# EasyEDA Pro project 二版平衡车pcb.epro, board PCB3
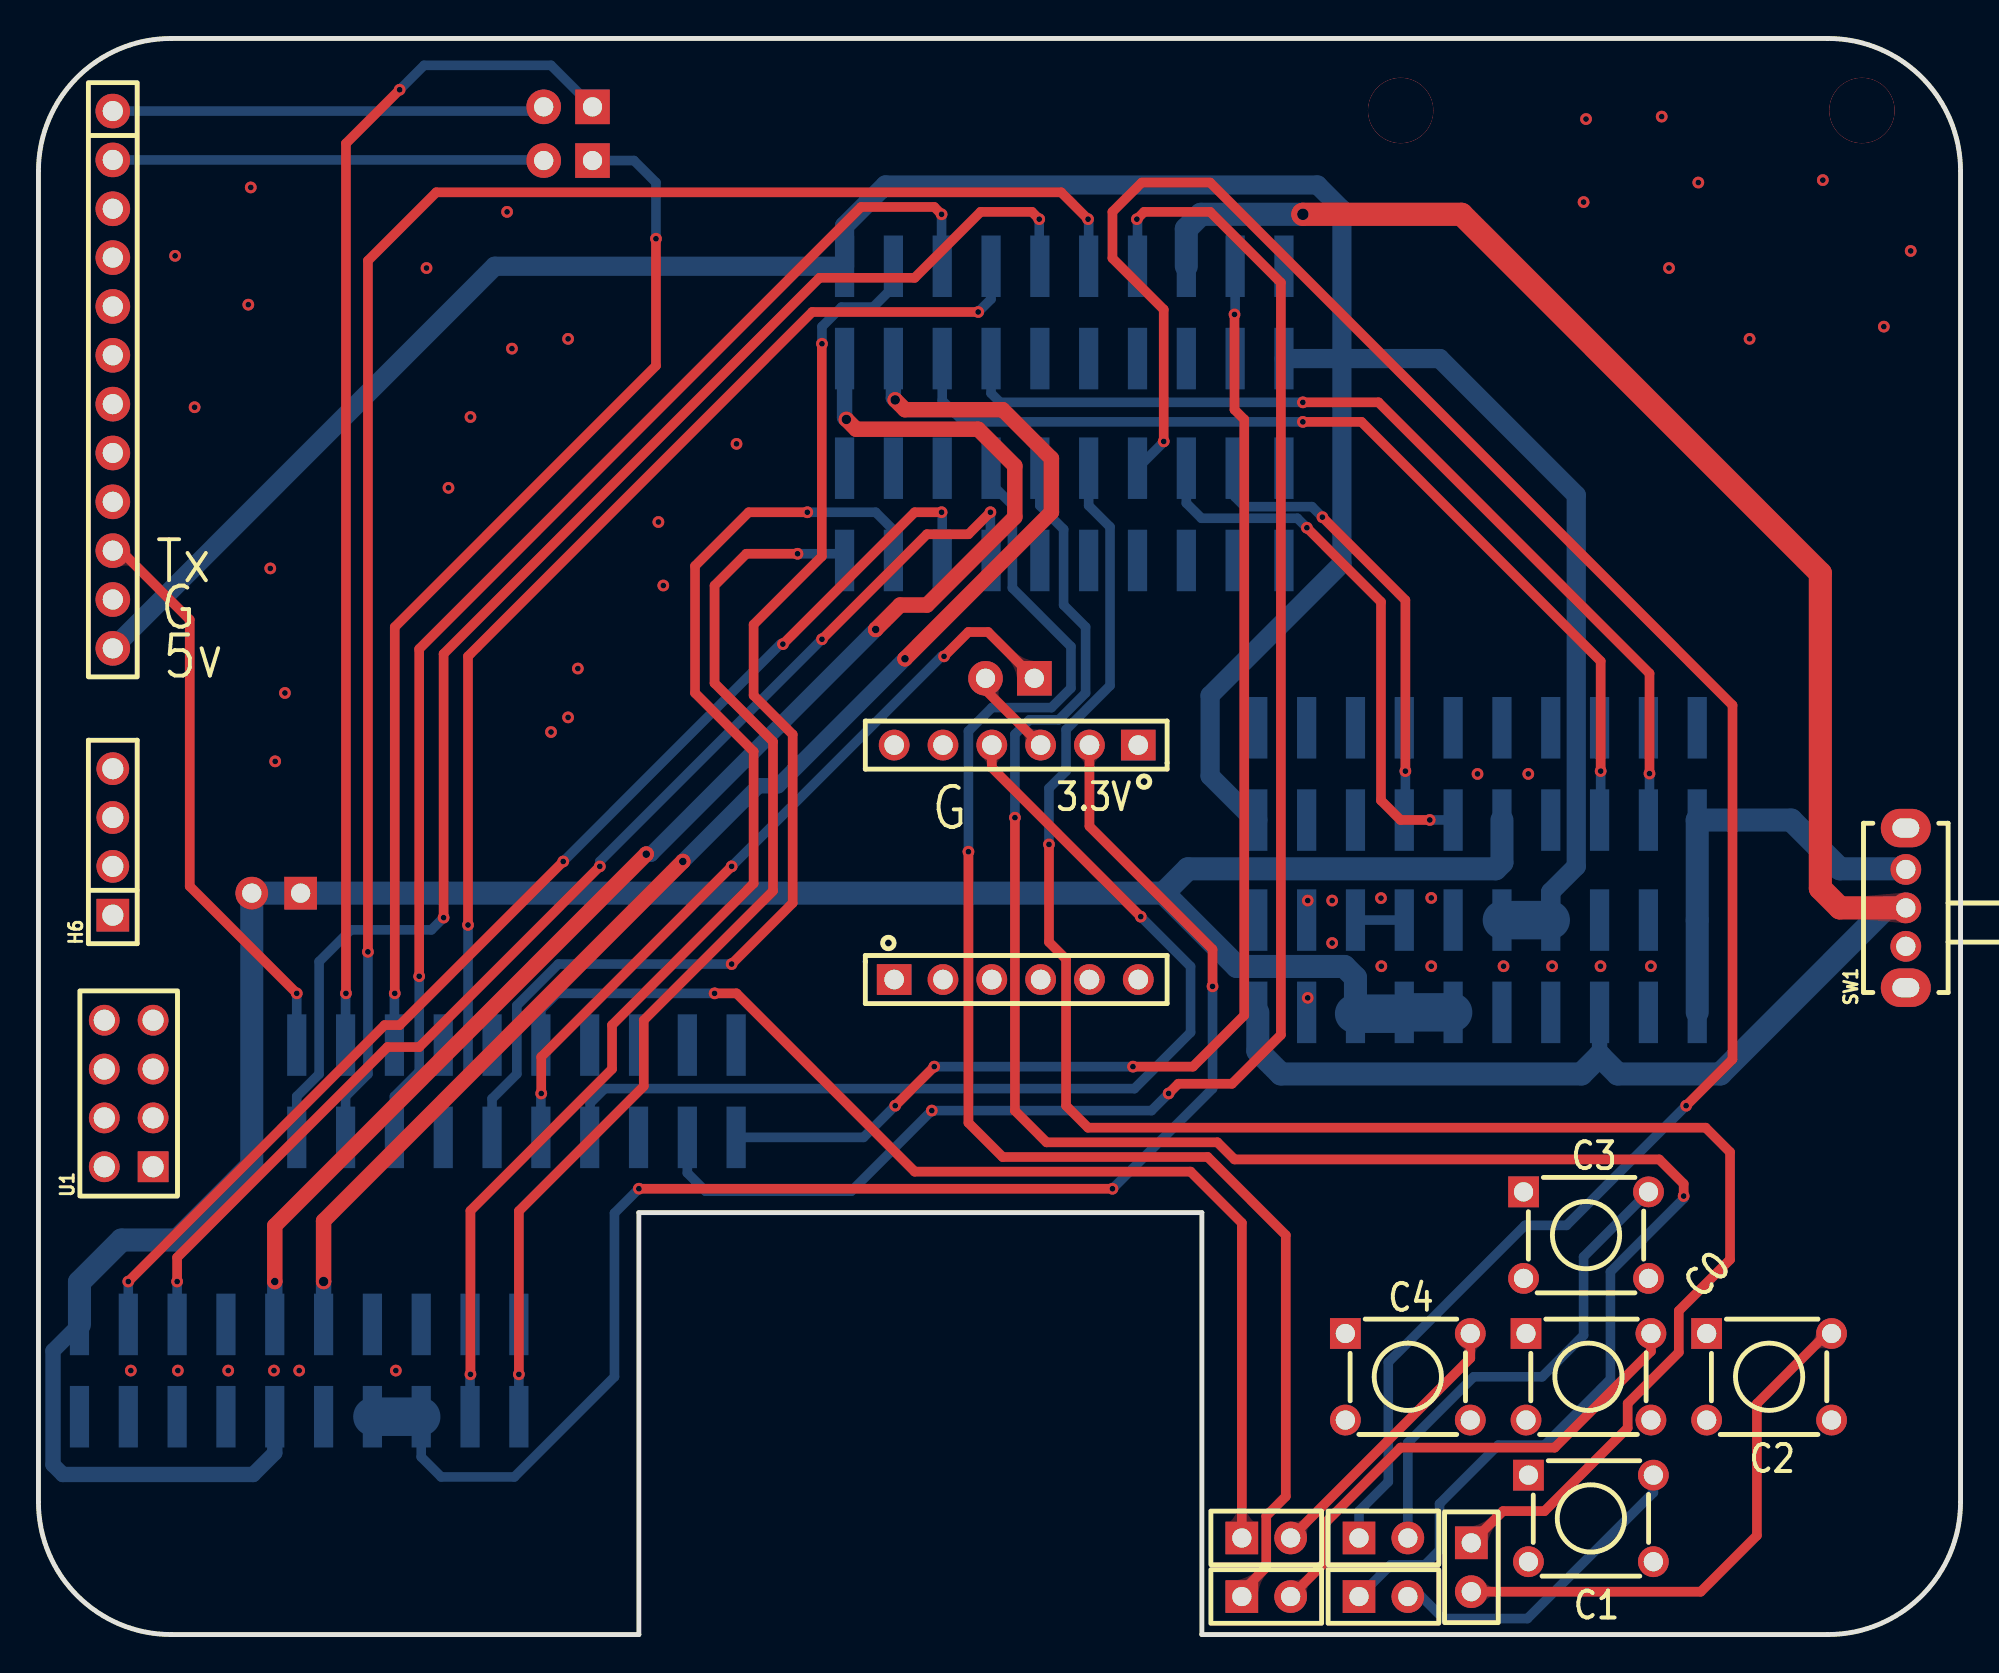
[diagram p4: board, top side]
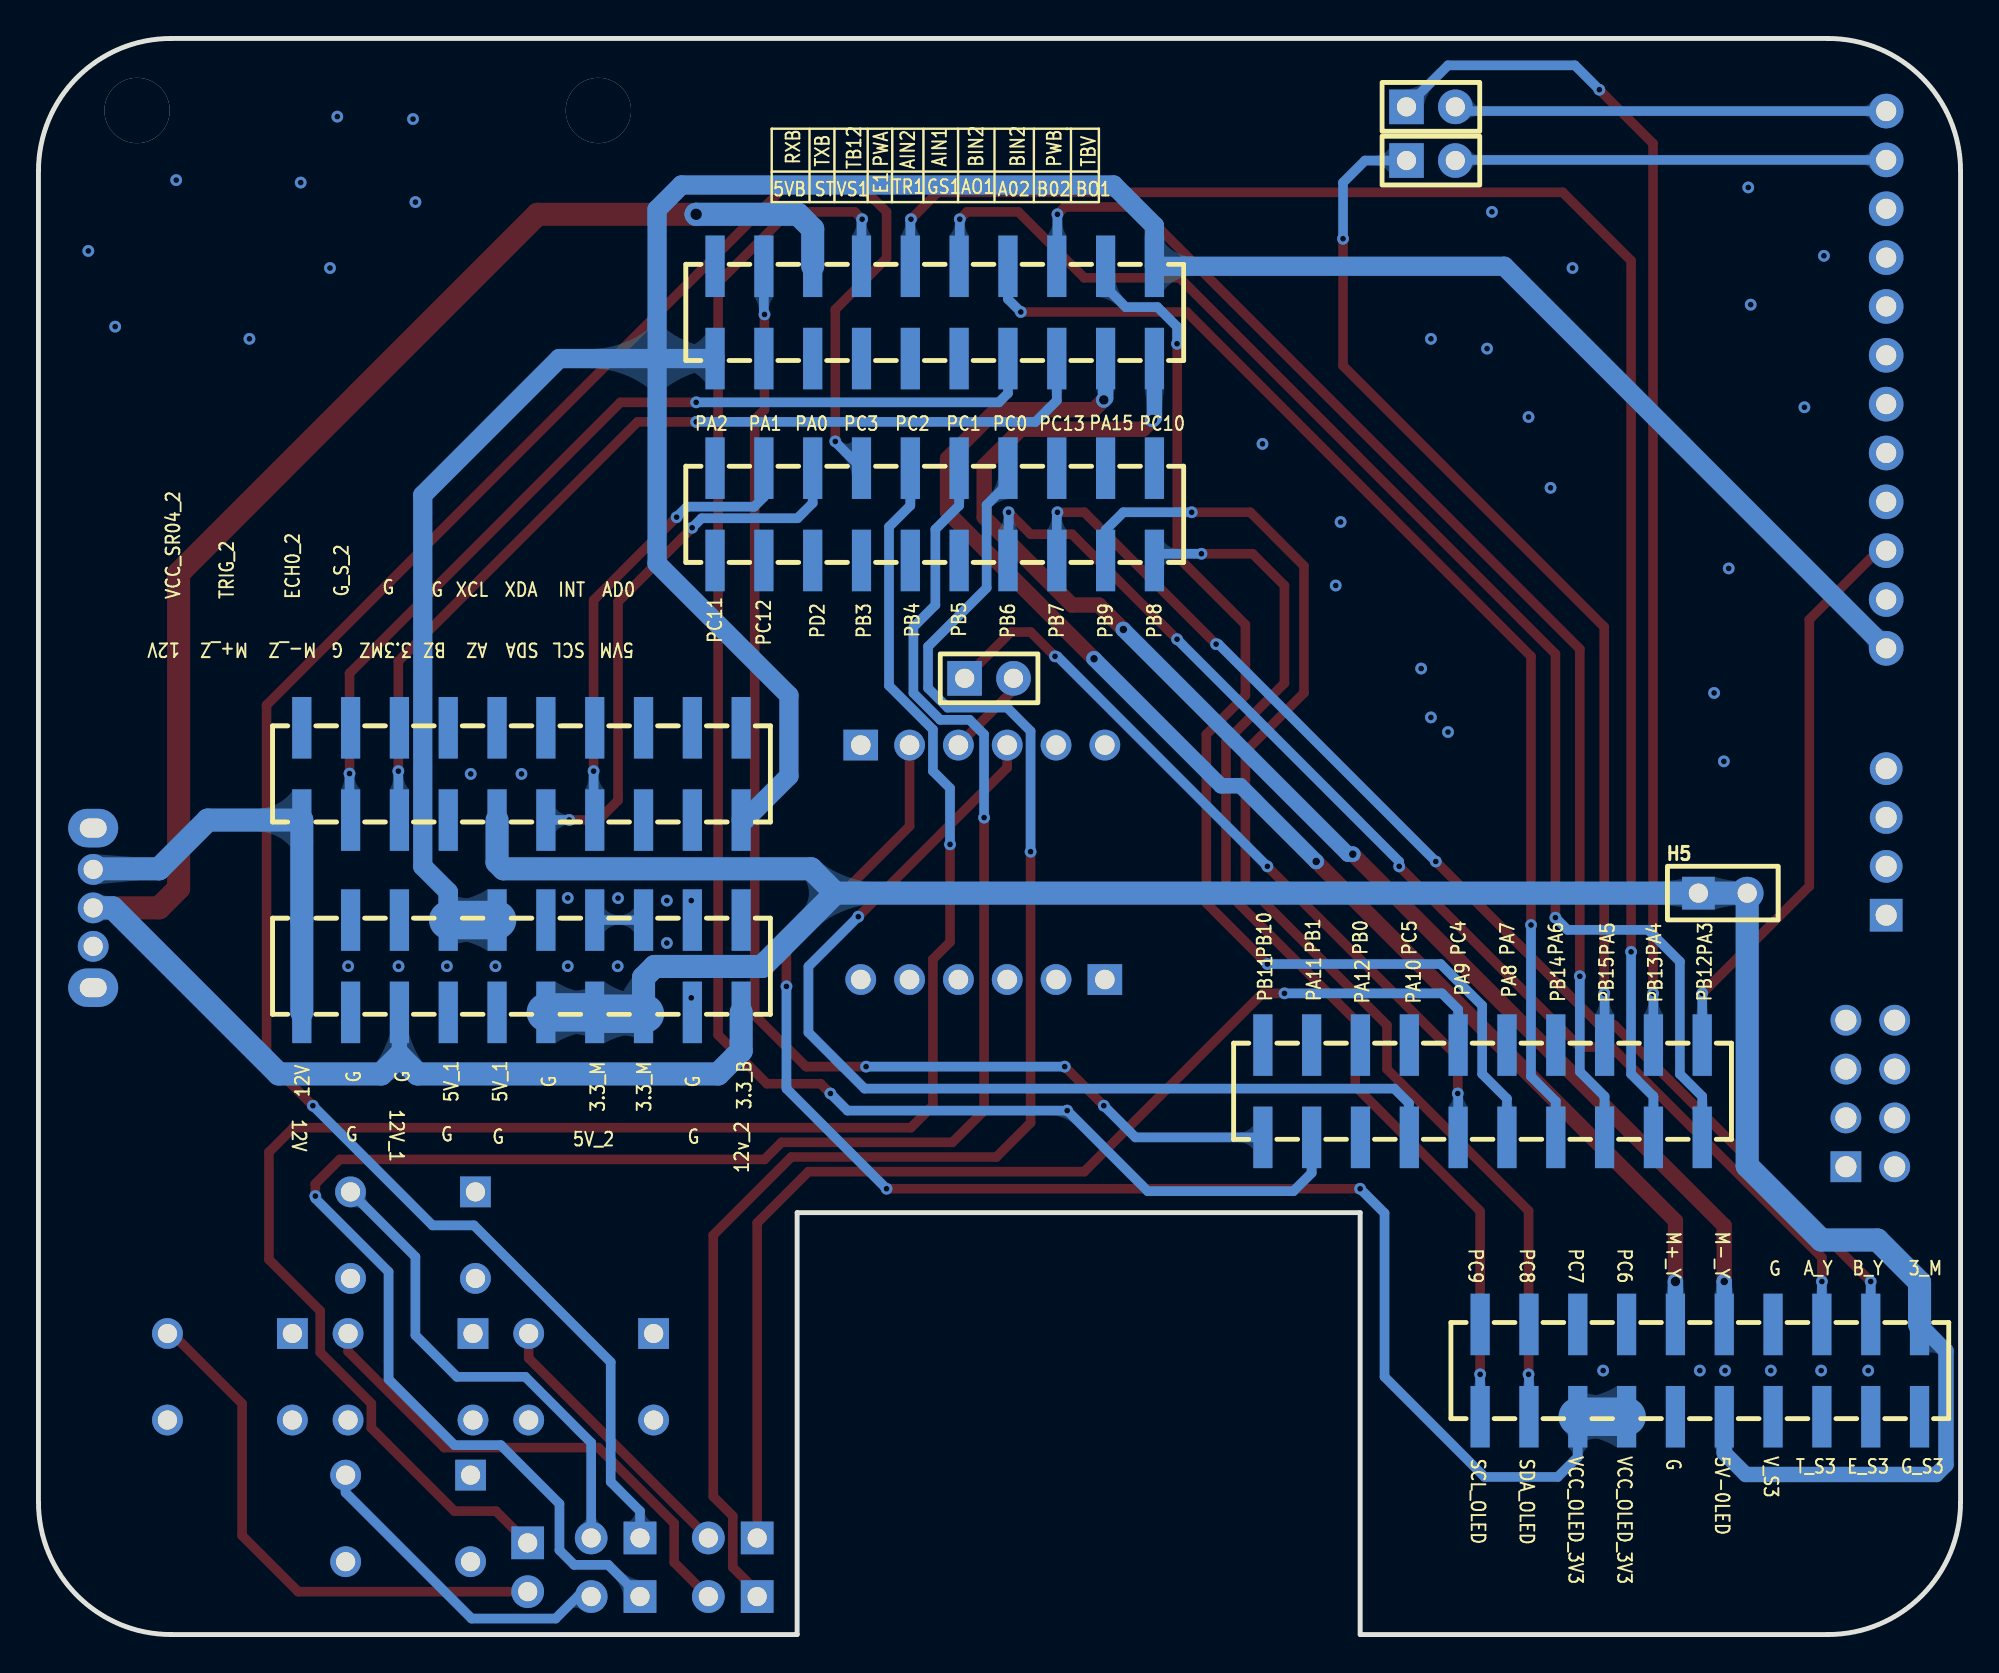
[diagram p5: board, bottom side, seen from below]

Outline 100 x 83 mm; copper layers: Top Layer, Bottom Layer. Coordinates in mm from the lower left corner of the outline.
Outline path: 0,76.1 0,6.9 arc(2.02,2.02) 6.9,0 31.24,0 31.24,21.94 60.53,21.94 60.53,0 93.1,0 arc(97.98,2.02) 100,6.9 100,76.1 arc(97.98,80.98) 93.1,83 6.9,83 arc(2.02,80.98) 0,76.1
Stack: Top Layer 0.035mm / Dielectric1 1.51mm FR4 er 4.5 / Bottom Layer 0.035mm

## Design rules (mm)
template: JLCPCB Capability(Two Layers Board)
spacing copperThickness1oz (default): track to track 0.102, other pairs 0.152 to 0.3
spacing copperThickness2oz: track to track 0.203, other pairs 0.152 to 0.3
track width copperThickness1oz (default): min 0.127, default 0.254, max 2.54
track width copperThickness2oz: min 0.203, default 0.254, max 2.54
differential pair differentialPair (default): width min 0.127, default 0.254, max 2.54; gap min 0.152, default 0.152
via viaSize (default): diameter min 0.5, default 0.61, max 10; hole min 0.3, default 0.305, max 6.3

## Placement (name value [footprint] x y rotation side)
CN1  PM254-2-10-S-8.5  [HDR-SMD_20P-P2.54-V-F-R2-C10-S2.54-LS7.1]  53.37 58.25 180 bottom
CN2  PM254-2-10-S-8.5  [HDR-SMD_20P-P2.54-V-F-R2-C10-S2.54-LS7.1]  74.87 44.75 180 bottom
CN3  PM254-2-10-S-8.5  [HDR-SMD_20P-P2.54-V-F-R2-C10-S2.54-LS7.1]  13.56 13.73 180 bottom
CN4  PM254-2-10-S-8.5  [HDR-SMD_20P-P2.54-V-F-R2-C10-S2.54-LS7.1]  53.37 68.75 180 bottom
CN5  PM254-2-10-S-8.5  [HDR-SMD_20P-P2.54-V-F-R2-C10-S2.54-LS7.1]  74.87 34.75 180 bottom
CN6  PM254-2-10-S-8.5  [HDR-SMD_20P-P2.54-V-F-R2-C10-S2.54-LS7.1]  24.87 28.25 180 bottom
H1  -  [HDR-TH_6P-P2.54-V-F]  50.87 46.25 180 top
H2  -  [HDR-TH_6P-P2.54-V-F]  50.87 34.06 0 top
H3  -  [HDR-TH_12P-P2.54-V-F]  3.87 65.25 270 top
H4  -  [HDR-TH_2P-P2.54-V-M-1]  50.54 49.73 180 bottom
H5  -  [HDR-TH_2P-P2.54-V-F]  12.37 38.55 180 bottom
H6  -  [HDR-TH_4P-P2.54-V-F]  3.87 41.22 90 top
H7  -  [HDR-TH_2P-P2.54-V-M-1]  27.56 79.44 180 bottom
H8  -  [HDR-TH_2P-P2.54-V-M-1]  27.56 76.65 180 bottom
H9  -  [HDR-TH_2P-P2.54-V-F]  63.88 5.02 0 top
H10  -  [HDR-TH_2P-P2.54-V-F]  69.97 5.02 0 top
H11  -  [HDR-TH_2P-P2.54-V-F]  74.55 3.5 270 top
H12  -  [HDR-TH_2P-P2.54-V-F]  69.97 1.97 0 top
H13  -  [HDR-TH_2P-P2.54-V-F]  63.88 1.97 0 top
KEY1  AN6*6  [KEY-TH_4P-L6.0-W6.0-P6.50-LS4.5]  71.24 13.4 0 top
KEY2  AN6*6  [KEY-TH_4P-L6.0-W6.0-P6.50-LS4.5]  80.51 20.77 0 top
KEY3  AN6*6  [KEY-TH_4P-L6.0-W6.0-P6.50-LS4.5]  90.04 13.4 0 top
KEY4  AN6*6  [KEY-TH_4P-L6.0-W6.0-P6.50-LS4.5]  80.77 6.04 0 top
KEY5  AN6*6  [KEY-TH_4P-L6.0-W6.0-P6.50-LS4.5]  80.64 13.4 0 top
SW1  SK12D07VG3  [SW-TH_SK12D07VG3]  97.15 37.79 90 top
U1  2.54-2*4  [HDR-TH_8P-P2.54-V-F-R2-C4-S2.54]  4.7 28.14 90 top

## Footprints (pads in the part's own frame, mm; a bottom-side part is the same pattern mirrored in y, then rotated)
HDR-SMD_20P-P2.54-V-F-R2-C10-S2.54-LS7.1
  rect 1x3.2 smd: 1(-11.43,-2.4) 2(-11.43,2.4) 3(-8.89,-2.4) 4(-8.89,2.4) 5(-6.35,-2.4) 6(-6.35,2.4) 7(-3.81,-2.4) 8(-3.81,2.4) 9(-1.27,-2.4) 10(-1.27,2.4) 11(1.27,-2.4) 12(1.27,2.4) 13(3.81,-2.4) 14(3.81,2.4) 15(6.35,-2.4) 16(6.35,2.4) 17(8.89,-2.4) 18(8.89,2.4) 19(11.43,-2.4) 20(11.43,2.4)
HDR-TH_2P-P2.54-V-F
  rect 1.7x1.7 hole 1: 1(-1.27,0)
  round 1.7 hole 1: 2(1.27,0)
HDR-TH_2P-P2.54-V-M-1
  rect 1.8x1.8 hole 1: 1(-1.27,0)
  round 1.8 hole 1: 2(1.27,0)
HDR-TH_4P-P2.54-V-F
  rect 1.7x1.7 hole 1.1: 1(-3.81,0)
  round 1.7 hole 1.1: 2(-1.27,0) 3(1.27,0) 4(3.81,0)
HDR-TH_6P-P2.54-V-F
  rect 1.8x1.6 hole 1.02: 1(-6.35,0)
  round 1.6 hole 1.02: 2(-3.81,0) 3(-1.27,0) 4(1.27,0) 5(3.81,0) 6(6.35,0)
HDR-TH_8P-P2.54-V-F-R2-C4-S2.54
  rect 1.6x1.6 hole 1.1: 1(-3.81,-1.27)
  round 1.6 hole 1.1: 2(-3.81,1.27) 3(-1.27,-1.27) 4(-1.27,1.27) 5(1.27,-1.27) 6(1.27,1.27) 7(3.81,-1.27) 8(3.81,1.27)
HDR-TH_12P-P2.54-V-F
  round 1.8 hole 1.05: 1(-13.97,0) 2(-11.43,0) 3(-8.89,0) 4(-6.35,0) 5(-3.81,0) 6(-1.27,0) 7(1.27,0) 8(3.81,0) 9(6.35,0) 10(8.89,0) 11(11.43,0) 12(13.97,0)
KEY-TH_4P-L6.0-W6.0-P6.50-LS4.5
  rect 1.6x1.6 hole 1: 1(-3.25,2.25)
  round 1.6 hole 1: 2(3.25,2.25) 3(-3.25,-2.25) 4(3.25,-2.25)
SW-TH_SK12D07VG3
  oval 1.6x1.6 hole 1: 1(-2,0) 2(0,0) 3(2,0)
  oval 2x2.6 hole 1x1.4: 4(4.15,0) 5(-4.15,0)

## Nets
As in the schematic.

Pads without a net: H1 1 6; H2 1 2 3 4 5 6; H3 3 4 5 6 7 8 9; H6 1 2 3 4; KEY1 1 4; KEY2 1 4; KEY3 1 4; KEY4 1 4; KEY5 1 4; SW1 1 4 5; U1 1 2 3 4 5 6 7 8

## Via types
v1: diameter 3.4, hole 3.4, Top Layer to Bottom Layer, 2 vias
v2: diameter 0.61, hole 0.305, Top Layer to Bottom Layer, 104 vias
v3: diameter 0.8, hole 0.5, Top Layer to Bottom Layer, 3 vias
v4: diameter 0.8, hole 0.4, Top Layer to Bottom Layer, 5 vias
v5: diameter 1.2, hole 0.6, Top Layer to Bottom Layer, 1 via

## Routing (per net, layer and track width the routed paths; a pad name or vN(x,y) marks a point on that pad's centre or on a via; arc(x,y) is an arc through that point)
5V_1: length 154.8
  Bottom Layer w1: 67.81,66.35 67.81,55.69 60.96,48.84 60.96,44.65 63.25,42.35 CN2.19 ; 67.81,66.35 72.9,66.35 80.01,59.25 80.01,39.95 78.68,38.62 CN5.8 ; 67.81,66.35 CN4.1 ; 67.81,66.35 67.81,74.11 66.54,75.38 44.07,75.38 41.94,73.25 CN4.20 23.74,71.15 H3.12
  Bottom Layer w2: CN5.8 CN5.10
5V_2: length 136.6
  Bottom Layer w0.8: CN3.11 12.29,9.45 11.17,8.32 1.27,8.32 0.76,8.83 0.76,14.75 2.13,16.13
  Bottom Layer w1.2: 58.54,38.55 62.35,34.74 67.94,34.74 68.52,34.16 CN5.15 68.45,32.28 ; 58.54,38.55 H5.1 H5.2 11.1,24.38 7.24,20.52 4.32,20.52 2.13,18.33 2.13,16.13 ; 58.54,38.55 59.81,39.82 75.81,39.82 76.14,40.15 CN2.9
  Bottom Layer w2: 68.45,32.28 70.99,32.28 CN5.13 CN5.11
12V: length 21.9
  Bottom Layer w1.2: SW1.3 97.12,39.82 93.72,39.82 91.19,42.35 CN2.1 CN5.2 CN5.1
12V_1: length 107.1
  Top Layer w1.2: v5(65.78,73.86) 74.04,73.86 92.71,55.19 92.71,38.8 93.72,37.79 SW1.2
  Bottom Layer w0.8: 81.22,30.1 CN5.5
  Bottom Layer w1.2: CN5.19 63.44,30.35 64.64,29.15 80.27,29.15 81.22,30.1 82.17,29.15 87.5,29.15 96.14,37.79 SW1.2 ; CN4.6 59.72,73.09 60.48,73.86 v5(65.78,73.86)
GND:
  vias: v2(4.81,13.73) v2(7.11,71.7) v2(7.25,13.73) v2(8.12,63.82) v2(9.87,13.73) v2(10.92,69.16) v2(11.05,75.25) v2(12.06,55.44) v2(12.32,45.41) v2(12.25,13.73) v2(12.82,48.96) v2(13.56,13.73) v2(18.59,13.73) v2(20.19,71.06) v2(21.33,59.63) v2(22.48,63.31) v2(24.38,73.98) v2(24.63,66.87) v2(26.67,46.93) v2(27.56,67.38) v2(27.56,47.69) v2(28.06,50.23) v2(32.25,57.85) v2(32.51,54.55) v2(36.32,61.92) v2(66.04,38.17) v2(66.04,33.11) v2(67.31,38.17) v2(67.31,35.96) v2(69.85,38.3) v2(69.87,34.75) v2(72.46,38.31) v2(72.46,34.75) v2(74.87,44.75) v2(76.22,34.75) v2(77.51,44.75) v2(78.75,34.75) v2(80.39,74.49) v2(80.51,78.81) v2(81.27,34.75) v2(83.89,34.75) v2(84.45,78.94) v2(84.83,71.06) v2(86.36,75.51) v2(89.02,67.38) v2(92.83,75.63) v2(96.01,68.01) v2(97.41,71.95)
VCC_3V3_MPU6050: length 2.5
  Bottom Layer w0.5: CN5.16 CN5.14
VCC_OLED: length 80.1
  Top Layer w0.5: v2(55.88,23.18) v2(31.24,23.18) ; v2(61.08,33.71) 61.08,35.63 54.68,42.03 H1.2
  Bottom Layer w0.5: CN3.5 19.91,9.23 20.95,8.2 24.76,8.2 29.97,13.4 29.97,21.91 v2(31.24,23.18) ; v2(61.08,33.71) 61.08,28.39 v2(55.88,23.18)
  Bottom Layer w2: CN3.5 CN3.7
(no net):
  vias: v1(70.87,79.25) v1(94.87,79.25)
A02: length 50.3
  Top Layer w0.5: v2(65.78,63.06) 68.83,63.06 81.28,50.61 v2(81.28,44.9)
  Bottom Layer w0.5: v2(65.78,63.06) 48.13,63.06 47.02,64.17 CN4.15 ; v2(81.28,44.9) 81.28,42.41 CN2.5
A_Y: length 64.5
  Top Layer w0.5: v2(29.21,39.95) 19.81,30.55 18.16,30.55 7.21,19.61 v2(7.21,18.36) ; v2(40.76,51.76) 46.22,57.22 48.38,57.22 v2(49.53,58.36)
  Bottom Layer w0.5: v2(49.53,58.36) 49.53,55.89 CN1.13 ; v2(29.21,39.95) 29.21,40.2 v2(40.76,51.76) ; 7.21,16.13 v2(7.21,18.36)
A_Z: length 24
  Top Layer w0.5: v2(71.12,44.9) 71.12,53.79 v2(66.8,58.11)
  Bottom Layer w0.5: CN1.4 62.26,59.15 62.76,58.65 66.26,58.65 v2(66.8,58.11) ; CN2.13 71.12,42.41 v2(71.12,44.9)
AIN1: length 73.9
  Top Layer w0.5: v2(52.07,73.6) 51.69,73.98 49.02,73.98 45.59,70.55 40.64,70.55 21.08,51 v2(21.08,37.28)
  Bottom Layer w0.5: v2(52.07,73.6) 52.07,71.19 CN4.12 ; CN6.19 13.44,27.98 14.6,29.15 14.6,34.99 16.25,36.64 20.44,36.64 v2(21.08,37.28)
AIN2: length 88
  Top Layer w0.5: v2(54.61,73.6) 53.21,75 20.7,75 17.14,71.44 v2(17.14,35.5)
  Bottom Layer w0.5: v2(17.14,35.5) 17.14,29.15 15.98,27.98 CN6.17 ; v2(54.61,73.6) 54.64,73.57 CN4.10
AO1: length 49.7
  Top Layer w0.5: v2(83.82,44.77) 83.82,49.98 69.72,64.08 v2(65.78,64.08)
  Bottom Layer w0.5: CN4.13 49.56,64.55 50.03,64.08 v2(65.78,64.08) ; CN2.3 83.82,42.41 v2(83.82,44.77)
AR_TX: length 29.9
  Top Layer w0.5: v2(13.44,33.34) 7.87,38.91 7.87,52.77 4.28,56.36 H3.10
  Bottom Layer w0.5: CN6.20 v2(13.44,33.34)
B02: length 72.9
  Top Layer w0.8: v3(14.83,18.36) 14.83,21.51 v4(33.52,40.2) ; v3(44.57,64.2) 45.08,63.7 50.16,63.7 52.7,61.16 52.7,58.36 v4(45.08,50.74)
  Bottom Layer w0.8: v3(44.57,64.2) 44.48,64.3 CN4.17 ; 14.83,16.13 v3(14.83,18.36) ; v4(33.52,40.2) 37.46,44.14 38.48,44.14 v4(45.08,50.74)
B_Y: length 63.6
  Top Layer w0.5: v2(27.3,40.2) 18.79,31.69 18.01,31.69 v2(4.67,18.36) ; v2(38.73,51.5) 45.59,58.36 v2(46.99,58.36)
  Bottom Layer w0.5: v2(27.3,40.2) 38.6,51.5 v2(38.73,51.5) ; v2(46.99,58.36) 47.02,58.33 CN1.15 ; 4.67,16.13 v2(4.67,18.36)
B_Z: length 28.6
  Top Layer w0.5: v2(65.99,57.56) 69.85,53.7 69.85,43.38 70.86,42.36 v2(72.39,42.36)
  Bottom Layer w0.5: v2(65.99,57.56) 65.5,58.05 60.51,58.05 59.72,58.84 CN1.6 ; CN2.11 73.59,42.36 v2(72.39,42.36)
BIN1: length 62.2
  Top Layer w0.5: v2(48.89,68.78) 40.26,68.78 22.35,50.87 v2(22.35,36.9)
  Bottom Layer w0.5: CN6.13 21.06,27.74 22.35,29.02 v2(22.35,36.9) ; v2(48.89,68.78) 49.56,69.44 CN4.14
BIN2: length 65.5
  Top Layer w0.5: v2(19.81,34.23) 19.81,51.25 42.8,74.24 46.61,74.24 v2(46.99,73.86)
  Bottom Layer w0.5: v2(46.99,73.86) 46.99,71.19 CN4.16 ; v2(19.81,34.23) 19.81,29.27 18.52,27.98 CN6.15
BO1: length 74.5
  Top Layer w0.8: v3(42.03,63.19) 42.54,62.68 48.89,62.68 50.8,60.77 50.8,58.11 46.22,53.54 44.83,53.54 v4(43.56,52.27) ; v4(31.62,40.58) 12.29,21.26 v4(12.29,18.36)
  Bottom Layer w0.8: v4(43.56,52.27) 31.87,40.58 v4(31.62,40.58) ; CN4.19 41.94,63.28 v3(42.03,63.19) ; 12.29,16.13 v4(12.29,18.36)
HC05_TX: length 68.2
  Top Layer w0.5: v2(56.94,29.53) 60.07,29.53 62.73,32.2 62.73,63.19 62.23,63.7 v2(62.23,68.65) ; v2(46.61,29.53) v2(44.57,27.5)
  Bottom Layer w0.5: CN6.1 42.93,25.85 v2(44.57,27.5) ; v2(56.94,29.53) v2(46.61,29.53) ; CN4.4 62.26,68.68 v2(62.23,68.65)
IO1: length 22.5
  Bottom Layer w0.5: H7.2 26.07,79.22 H3.1
IO2: length 22.4
  Bottom Layer w0.5: H8.2 26.25,76.68 H3.2
MPU_RX: length 4.7
  Top Layer w0.5: H1.3 49.27,49.12 H4.2
MPU_TX: length 53.8
  Top Layer w0.5: v2(57.35,37.33) 49.6,45.08 H1.4
  Bottom Layer w0.5: v2(57.35,37.33) 59.94,34.74 59.94,31.31 57.02,28.39 29.46,28.39 28.7,27.63 28.7,25.87 CN6.7
PA4: length 62.3
  Top Layer w0.5: v2(16,33.34) 16,77.54 v2(18.79,80.33)
  Bottom Layer w0.5: v2(18.79,80.33) 20.06,81.6 26.67,81.6 H7.1 ; CN6.18 15.98,33.32 v2(16,33.34)
PA5: length 54.3
  Top Layer w0.5: v2(18.54,33.34) 18.54,52.39 32.13,65.98 v2(32.13,72.59)
  Bottom Layer w0.5: v2(32.13,72.59) 32.13,75.51 30.98,76.65 H8.1 ; CN6.16 18.52,33.32 v2(18.54,33.34)
PA8: length 61.9
  Top Layer w0.5: v2(40.76,67.12) 40.76,67.12 40.76,56.07 37.21,52.52 37.21,48.84 39.24,46.8 39.24,38.04 v2(36.06,34.87)
  Bottom Layer w0.5: CN4.18 44.48,70.08 43.43,69.03 41.78,69.03 40.76,68.01 v2(40.76,67.12) ; CN6.11 23.6,27.86 24.89,29.15 24.89,32.71 27.05,34.87 v2(36.06,34.87)
PA9: length 40
  Top Layer w0.5: v2(26.16,28.14) 26.16,30.04 v2(36.06,39.95) ; H4.1 49.41,52.13 48.38,52.13 v2(47.11,50.87)
  Bottom Layer w0.5: v2(47.11,50.87) 46.99,50.87 v2(36.06,39.95) ; CN6.9 26.14,28.12 v2(26.16,28.14)
PA11: length 87.2
  Top Layer w0.5: v2(57.15,73.6) 57.53,73.98 60.96,73.98 64.64,70.3 64.64,31.18 62.1,28.64 59.31,28.64 v2(58.8,28.14)
  Bottom Layer w0.5: CN4.8 57.18,73.57 v2(57.15,73.6) ; v2(58.8,28.14) 57.91,27.25 v2(46.48,27.25) 42.29,23.06 34.71,23.06 33.76,24 CN6.3
PB8: length 57.6
  Top Layer w0.5: v2(24.99,13.53) 24.99,22.02 31.49,28.52 31.49,31.95 38.22,38.67 38.22,46.43 35.18,49.47 35.18,54.55 36.83,56.2 v2(39.49,56.2)
  Bottom Layer w0.5: v2(39.49,56.2) 41.59,56.2 CN1.19 ; CN3.1 v2(24.99,13.53)
PB9: length 65.1
  Top Layer w0.5: v2(40,58.36) 36.95,58.36 34.16,55.57 34.16,48.96 37.21,45.92 37.21,39.06 29.84,31.69 29.84,29.41 22.48,22.04 v2(22.48,13.53)
  Bottom Layer w0.5: CN1.17 44.48,57.44 43.56,58.36 v2(40,58.36) ; CN3.3 22.45,13.51 v2(22.48,13.53)
PC0: length 78.5
  Top Layer w0.5: v2(48.38,40.71) 48.38,26.61 50.16,24.83 60.83,24.83 64.89,20.77 64.89,7.18 63.88,6.16 63.88,3.5 62.61,2.23 H13.1
  Bottom Layer w0.5: CN1.14 49.56,59.85 50.67,58.74 50.67,54.42 53.72,51.38 53.72,49.22 52.7,48.2 49.61,48.2 48.38,46.98 v2(48.38,40.71)
PC1: length 104.1
  Top Layer w0.5: v2(85.59,22.8) 85.59,23.44 84.32,24.71 62.23,24.71 61.34,25.6 52.45,25.6 50.8,27.24 v2(50.8,42.48)
  Bottom Layer w0.5: v2(85.59,22.8) 85.59,22.67 81.78,18.86 81.78,13.28 78.36,9.85 75.94,9.85 72.89,6.8 72.89,4.39 72.13,3.62 70.35,3.62 H12.1 ; CN1.12 52.1,58.71 53.34,57.47 53.34,53.54 54.48,52.39 54.48,48.96 53.08,47.57 51.56,47.57 50.8,46.81 v2(50.8,42.48)
PC2: length 98
  Top Layer w0.5: v2(52.57,41.09) 52.57,36.01 53.46,35.12 53.46,27.5 54.61,26.36 86.74,26.36 88.01,25.09 88.01,19.5 85.34,16.83 85.34,14.67 82.68,12.01 82.68,10.75 78.36,6.42 76.2,6.42 H11.1
  Bottom Layer w0.5: v2(52.57,41.09) 52.57,44.01 53.46,44.9 53.46,47.06 55.75,49.34 55.75,57.6 54.64,58.71 CN1.10
PC3: length 111.8
  Top Layer w0.5: v2(58.54,62.04) 58.54,68.9 55.88,71.57 55.88,73.98 57.4,75.51 60.96,75.51 88.13,48.33 88.13,29.91 v2(85.72,27.5)
  Bottom Layer w0.5: H10.1 68.7,6.42 70.23,7.94 70.23,14.17 77.34,21.28 79.5,21.28 v2(85.72,27.5) ; v2(58.54,62.04) 58.54,62.02 CN1.8
PC4: length 60
  Top Layer w0.5: H9.1 62.61,21.4 59.94,24.07 45.59,24.07 36.32,33.34 v2(35.18,33.34)
  Bottom Layer w0.5: CN6.10 26.14,32.5 26.98,33.34 v2(35.18,33.34)
$1N9862: length 14.5
  Top Layer w0.5: H9.2 74.49,14.37 KEY1.2
$1N9868: length 25.3
  Bottom Layer w0.5: KEY2.2 80.39,19.64 80.39,15.56 78.23,13.4 74.67,13.4 71.24,9.97 H10.2
$1N9874: length 28.3
  Top Layer w0.5: KEY3.2 93.05,15.65 89.4,12.01 89.4,5.15 86.48,2.23 H11.2
$1N9880: length 16.9
  Bottom Layer w0.5: KEY4.2 84.02,7.38 77.47,0.83 73.09,0.83 71.95,1.97 H12.2
$1N9886: length 25.9
  Top Layer w0.5: H13.2 66.93,3.75 66.93,5.78 70.86,9.72 78.89,9.72 83.89,14.73 83.89,15.43

## Copper pours and planes (outline as drawn; the poured copper is in the pictures)
5V_1 on Bottom Layer: 67.31,67.76 66.36,66.82 66.32,66.82 66.36,66.77 66.36,65.9 66.5,65.9 67.31,65.09 68.34,65.09 69.1,65.85 69.21,65.85 69.1,65.96 69.1,66.98 68.32,67.76
GND on Top Layer: -12.96,90.11 109.09,90.11 109.09,-9.84 -12.96,-9.84
GND on Bottom Layer: -19.69,92.78 116.84,92.78 116.84,-18.98 -19.69,-18.98

Small or netless copper shapes (teardrops, artwork), in the pictures only: 16 on Top Layer, 88 on Bottom Layer

## Text on the board
Bottom Silkscreen Layer: TBV | PWB | BIN2 | AIN1 | AIN2 | PWA | E1 | TB12 | TXB | RXB | BO1 | B02 | A02 | AO1 | GS1 | TR1 | VS1 | ST | 5VB | 5VM | SCL | SDA | AZ | BZ | 3.3MZ | G | M-_Z | M+_Z | 12V | PB9 | PB7 | G_S_2 | PC10 | PA15 | PC13 | PC0 | PC1 | PC2 | PC3 | PA0 | PA1 | PA2 | AD0 | INT | XDA | XCL | M-_Y | M+_Y | PC6 | PC7 | PC8 | PC9 | 12V_1 | PB12 | PB13 | PA5 | PB15 | PB14 | PA8 | PA7 | PA9 | PA10 | PA12 | PA11 | PB1 | PB11 | PB10 | PB8 | PB6 | PB5 | PB4 | PB3 | PD2 | PC12 | 3.3_B | 12v_2 | PC11 | 3.3_M | 5V_1 | ECH0_2 | TRIG_2 | VCC_SR04_2 | 3_M | B_Y | A_Y | 5V_2 | V_S3 | 5V-0LED | VCC_OLED_3V3 | SDA_OLED | SCL_OLED | PA3 | PA4 | PA6 | PC4 | PC5 | PB0 | G_S3 | E_S3 | T_S3
Top Silkscreen Layer: 3.3V | C4 | C3 | C1 | C2 | C0 | Tx | G | 5v
